# Altium schematic sheet Memory.SchDoc: SRAM & FLASH & SDRAM
size A4; DocumentNumber: MB1165; Revision: C.1; SheetNumber: 4; SheetTotal: 17; Project: STM32469I-EVAL
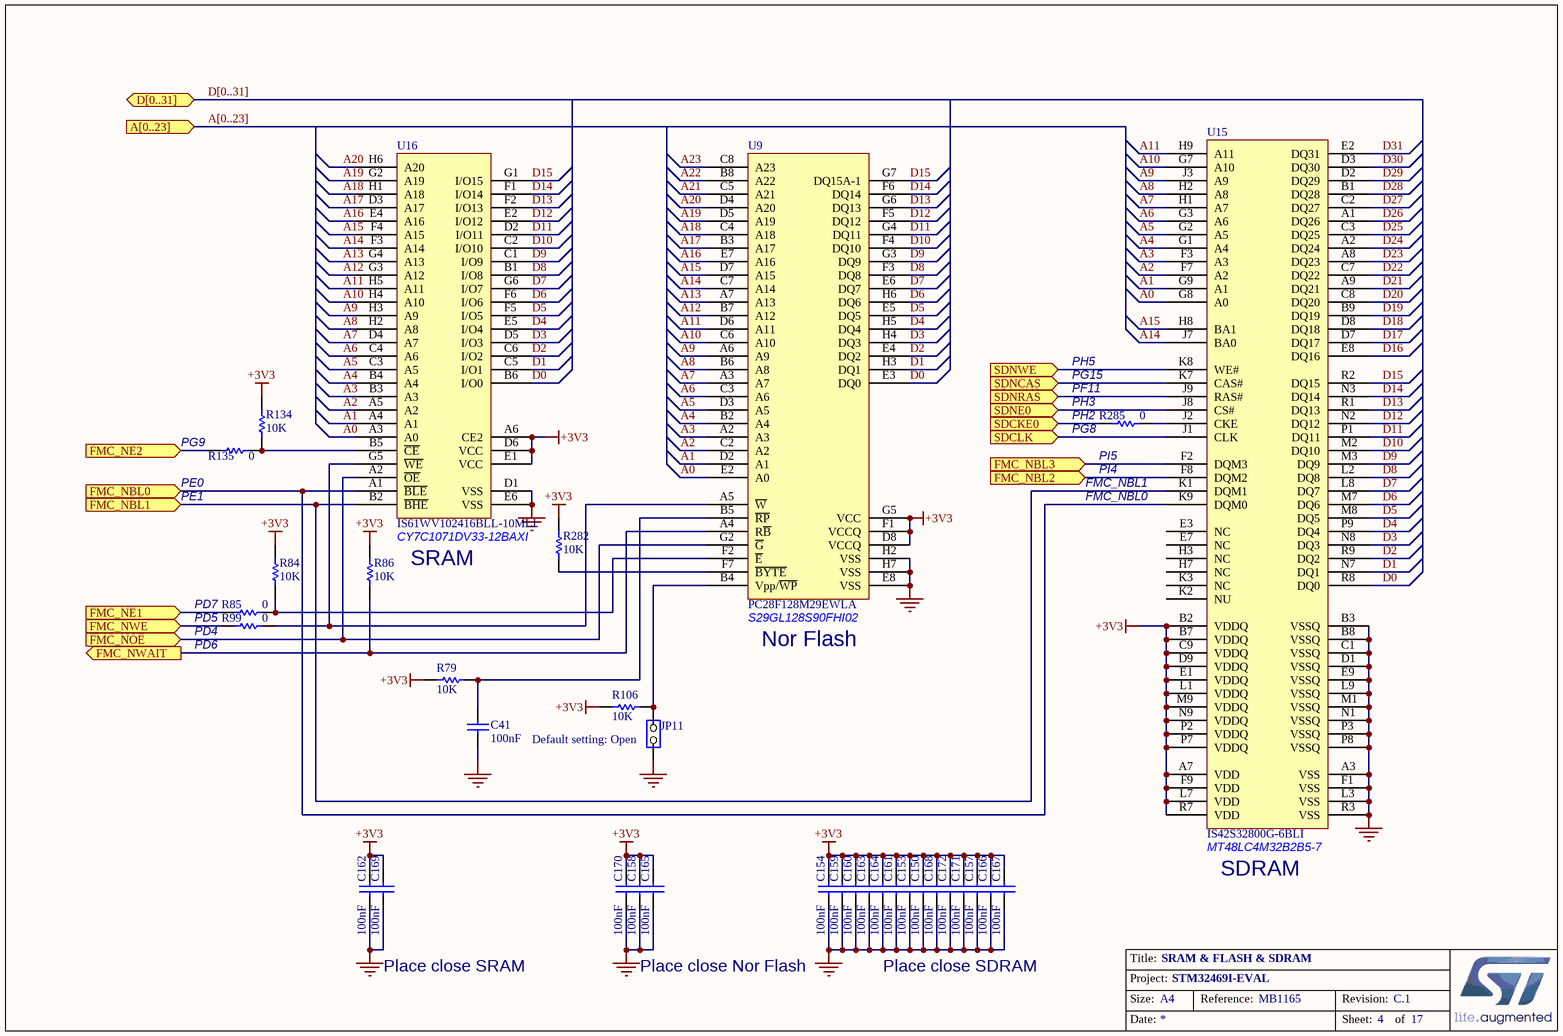
[diagram p0: Memory.SchDoc]

## Parts
C41  100nF  [0603C]
C150  100nF  [0603C]
C153  100nF  [0603C]
C154  100nF  [0603C]
C157  100nF  [0603C]
C158  100nF  [0603C]
C159  100nF  [0603C]
C160  100nF  [0603C]
C161  100nF  [0603C]
C162  100nF  [0603C]
C163  100nF  [0603C]
C164  100nF  [0603C]
C165  100nF  [0603C]
C166  100nF  [0603C]
C167  100nF  [0603C]
C168  100nF  [0603C]
C169  100nF  [0603C]
C170  100nF  [0603C]
C171  100nF  [0603C]
C172  100nF  [0603C]
JP11  (no value)  [SIP2]
R79  10K  [0603R]
R84  10K  [0603R]
R85  0  [0603R]
R86  10K  [0603R]
R99  0  [0603R]
R106  10K  [0603R]
R134  10K  [0603R]
R135  0  [0603R]
R282  10K  [0603R]
R285  0  [0603R]
U9  PC28F128M29EWLA  [FBGA64_1_11X13]
U15  IS42S32800G-6BLI  [FBGA90_0R8_8X13]
U16  IS61WV102416BLL-10MLI  [BGA48_0R75_9X11]

## Ports
A[0..23] (in), D[0..31] (bidir), FMC_NBL0 (in), FMC_NBL1 (in), FMC_NBL2 (in), FMC_NBL3 (in), FMC_NE1 (in), FMC_NE2 (in), FMC_NOE (in), FMC_NWAIT (out), FMC_NWE (in), SDCKE0 (in), SDCLK (in), SDNCAS (in), SDNE0 (in), SDNRAS (in), SDNWE (in)

## Nets
+3V3: C150.1 C153.1 C154.1 C157.1 C158.1 C159.1 C160.1 C161.1 C162.1 C163.1 C164.1 C165.1 C166.1 C167.1 C168.1 C169.1 C170.1 C171.1 C172.1 R79.1 R84.2 R86.2 R106.2 R134.2 R282.2 U9.D8(VCCQ) U9.F1(VCCQ) U9.G5(VCC) U15.A7(VDD) U15.B2(VDDQ) U15.B7(VDDQ) U15.C9(VDDQ) U15.D9(VDDQ) U15.E1(VDDQ) U15.F9(VDD) U15.L1(VDDQ) U15.L7(VDD) U15.M9(VDDQ) U15.N9(VDDQ) U15.P2(VDDQ) U15.P7(VDDQ) U15.R7(VDD) U16.A6(CE2) U16.D6(VCC) U16.E1(VCC)
GND: C41.2 C150.2 C153.2 C154.2 C157.2 C158.2 C159.2 C160.2 C161.2 C162.2 C163.2 C164.2 C165.2 C166.2 C167.2 C168.2 C169.2 C170.2 C171.2 C172.2 JP11.1(COMMON) U9.E8(VSS) U9.H2(VSS) U9.H7(VSS) U15.A3(VSS) U15.B3(VSSQ) U15.B8(VSSQ) U15.C1(VSSQ) U15.D1(VSSQ) U15.E9(VSSQ) U15.F1(VSS) U15.L3(VSS) U15.L9(VSSQ) U15.M1(VSSQ) U15.N1(VSSQ) U15.P3(VSSQ) U15.P8(VSSQ) U15.R3(VSS) U16.D1(VSS) U16.E6(VSS)
A0: U9.E2(A0) U15.G8(A0) U16.A3(A0)
A1: U9.D2(A1) U15.G9(A1) U16.A4(A1)
A2: U9.C2(A2) U15.F7(A2) U16.A5(A2)
A3: U9.A2(A3) U15.F3(A3) U16.B3(A3)
A4: U9.B2(A4) U15.G1(A4) U16.B4(A4)
A5: U9.D3(A5) U15.G2(A5) U16.C3(A5)
A6: U9.C3(A6) U15.G3(A6) U16.C4(A6)
A7: U9.A3(A7) U15.H1(A7) U16.D4(A7)
A8: U9.B6(A8) U15.H2(A8) U16.H2(A8)
A9: U9.A6(A9) U15.J3(A9) U16.H3(A9)
A10: U9.C6(A10) U15.G7(A10) U16.H4(A10)
A11: U9.D6(A11) U15.H9(A11) U16.H5(A11)
A12: U9.B7(A12) U16.G3(A12)
A13: U9.A7(A13) U16.G4(A13)
A14: U9.C7(A14) U15.J7(BA0) U16.F3(A14)
A15: U9.D7(A15) U15.H8(BA1) U16.F4(A15)
A16: U9.E7(A16) U16.E4(A16)
A17: U9.B3(A17) U16.D3(A17)
A18: U9.C4(A18) U16.H1(A18)
A19: U9.D5(A19) U16.G2(A19)
A20: U9.D4(A20) U16.H6(A20)
A21: U9.C5(A21)
A22: U9.B8(A22)
A23: U9.C8(A23)
D0: U9.E3(DQ0) U15.R8(DQ0) U16.B6(I/O0)
D1: U9.H3(DQ1) U15.N7(DQ1) U16.C5(I/O1)
D2: U9.E4(DQ2) U15.R9(DQ2) U16.C6(I/O2)
D3: U9.H4(DQ3) U15.N8(DQ3) U16.D5(I/O3)
D4: U9.H5(DQ4) U15.P9(DQ4) U16.E5(I/O4)
D5: U9.E5(DQ5) U15.M8(DQ5) U16.F5(I/O5)
D6: U9.H6(DQ6) U15.M7(DQ6) U16.F6(I/O6)
D7: U9.E6(DQ7) U15.L8(DQ7) U16.G6(I/O7)
D8: U9.F3(DQ8) U15.L2(DQ8) U16.B1(I/O8)
D9: U9.G3(DQ9) U15.M3(DQ9) U16.C1(I/O9)
D10: U9.F4(DQ10) U15.M2(DQ10) U16.C2(I/O10)
D11: U9.G4(DQ11) U15.P1(DQ11) U16.D2(I/O11)
D12: U9.F5(DQ12) U15.N2(DQ12) U16.E2(I/O12)
D13: U9.G6(DQ13) U15.R1(DQ13) U16.F2(I/O13)
D14: U9.F6(DQ14) U15.N3(DQ14) U16.F1(I/O14)
D15: U9.G7(DQ15A-1) U15.R2(DQ15) U16.G1(I/O15)
D16: U15.E8(DQ16)
D17: U15.D7(DQ17)
D18: U15.D8(DQ18)
D19: U15.B9(DQ19)
D20: U15.C8(DQ20)
D21: U15.A9(DQ21)
D22: U15.C7(DQ22)
D23: U15.A8(DQ23)
D24: U15.A2(DQ24)
D25: U15.C3(DQ25)
D26: U15.A1(DQ26)
D27: U15.C2(DQ27)
D28: U15.B1(DQ28)
D29: U15.D2(DQ29)
D30: U15.D3(DQ30)
D31: U15.E2(DQ31)
FMC_NBL0: U15.K9(DQM0) U16.A1(~{BLE}) ; port FMC_NBL0
FMC_NBL1: U15.K1(DQM1) U16.B2(~{BHE}) ; port FMC_NBL1
FMC_NBL2: U15.F8(DQM2) ; port FMC_NBL2
FMC_NBL3: U15.F2(DQM3) ; port FMC_NBL3
FMC_NE1: R85.2 ; port FMC_NE1
FMC_NE2: R135.2 ; port FMC_NE2
FMC_NOE: U9.G2(~{G}) U16.A2(~{OE}) ; port FMC_NOE
FMC_NWAIT: R86.1 U9.A4(R~{B}) ; port FMC_NWAIT
FMC_NWE: R99.2 ; port FMC_NWE
SDCKE0: R285.2 ; port SDCKE0
SDCLK: U15.J1(CLK) ; port SDCLK
SDNCAS: U15.K7(CAS#) ; port SDNCAS
SDNE0: U15.J8(CS#) ; port SDNE0
SDNRAS: U15.J9(RAS#) ; port SDNRAS
SDNWE: U15.K8(WE#) ; port SDNWE
NetC41_1: C41.1 R79.2 U9.B5(~{RP})
NetJP11_2: JP11.2(NO) R106.1 U9.B4(Vpp/~{WP})
NetR84_1: R84.1 R85.1 U9.F2(~{E})
NetR99_1: R99.1 U9.A5(~{W}) U16.G5(~{WE})
NetR134_1: R134.1 R135.1 U16.B5(~{CE})
NetR282_1: R282.1 U9.F7(~{BYTE})
NetR285_1: R285.1 U15.J2(CKE)

Not connected (* = marked no-connect by the designer): U15 E3(NC) E7(NC) H3(NC) H7(NC) K2(NU) K3(NC)

## Buses and harness runs
bus A[0..23] = port A[0..23]
bus D[0..31] = port D[0..31]

## Notes on the sheet
- PH5
- (near R285) PG15
- (near R135) PG9
- (near R285) PF11
- (near R285) PH3
- (near R285) PH2
- (near R285) PG8
- (near R135) PE1
- (near R135) PE0
- FMC_NBL1
- FMC_NBL0
- (near R285) PI5
- (near R285) PI4
- CY7C1071DV33-12BAXI
- SRAM
- PD5
- PD7
- PD6
- PD4
- (near U9) S29GL128S90FHI02
- (near U9) Nor Flash
- (near JP11) Default setting: Open
- (near U15) MT48LC4M32B2B5-7
- (near U15) SDRAM
- Place close SRAM
- Place close Nor Flash
- Place close SDRAM
- Title:
- Project:
- Size:
- Date:
- A4
- Reference:
- Sheet:
- Revision:
- of

## Library data of the parts
C41 C150 C153 C154 C157-C172 = Cap: Capacitor; Value: 10nF; Published: 8-Jun-2000; Revision: July-2002: Re-released for DXP Platform.; Publisher: Altium Limited
JP11 = JP2
R79 R84-R86 R99 R106 R134 R135 R282 R285 = Res1: Resistor; Value: 1K; Published: 8-Jun-2000; Revision: July-2002: Re-released for DXP Platform.; Publisher: Altium Limited
U9 = M29W128FL70ZA6E
U15 = MT48LC4M32B2B5